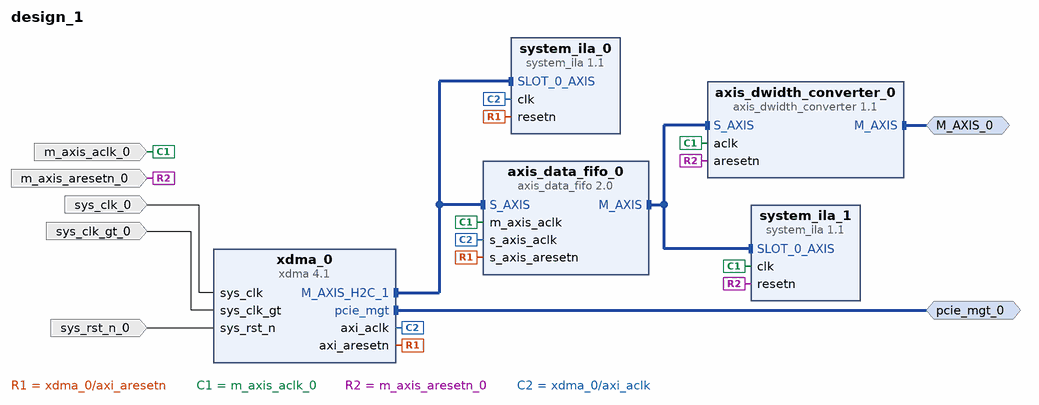
[diagram p0: block diagram of the top level]
# Vivado block design design_1, xcvu37p-fsvh2892-2L-e, Vivado 2020.2_AR75986
create_bd_design design_1

create_bd_intf_port -mode Master -vlnv xilinx.com:interface:axis_rtl:1.0 M_AXIS_0
create_bd_intf_port -mode Master -vlnv xilinx.com:interface:pcie_7x_mgt_rtl:1.0 pcie_mgt_0
create_bd_port -dir I -type clk m_axis_aclk_0
create_bd_port -dir I -type rst m_axis_aresetn_0
create_bd_port -dir I -type clk sys_clk_0
create_bd_port -dir I -type clk sys_clk_gt_0
create_bd_port -dir I -type rst sys_rst_n_0

create_bd_cell -type ip -vlnv xilinx.com:ip:axis_data_fifo:2.0 axis_data_fifo_0
set_property -dict {CONFIG.FIFO_DEPTH 16 CONFIG.IS_ACLK_ASYNC 1 CONFIG.TDATA_NUM_BYTES 64} [get_bd_cells axis_data_fifo_0]
create_bd_cell -type ip -vlnv xilinx.com:ip:axis_dwidth_converter:1.1 axis_dwidth_converter_0
set_property -dict {CONFIG.M_TDATA_NUM_BYTES 4 CONFIG.S_TDATA_NUM_BYTES 64} [get_bd_cells axis_dwidth_converter_0]
create_bd_cell -type ip -vlnv xilinx.com:ip:system_ila:1.1 system_ila_0
set_property -dict [list \
  CONFIG.C_MON_TYPE INTERFACE \
  CONFIG.C_NUM_MONITOR_SLOTS 1 \
  CONFIG.C_SLOT_0_APC_EN 0 \
  CONFIG.C_SLOT_0_AXI_DATA_SEL 1 \
  CONFIG.C_SLOT_0_AXI_TRIG_SEL 1 \
  CONFIG.C_SLOT_0_INTF_TYPE xilinx.com:interface:axis_rtl:1.0 \
] [get_bd_cells system_ila_0]
create_bd_cell -type ip -vlnv xilinx.com:ip:system_ila:1.1 system_ila_1
set_property -dict [list \
  CONFIG.C_MON_TYPE INTERFACE \
  CONFIG.C_NUM_MONITOR_SLOTS 1 \
  CONFIG.C_SLOT_0_APC_EN 0 \
  CONFIG.C_SLOT_0_AXI_DATA_SEL 1 \
  CONFIG.C_SLOT_0_AXI_TRIG_SEL 1 \
  CONFIG.C_SLOT_0_INTF_TYPE xilinx.com:interface:axis_rtl:1.0 \
] [get_bd_cells system_ila_1]
create_bd_cell -type ip -vlnv xilinx.com:ip:xdma:4.1 xdma_0
set_property -dict [list \
  CONFIG.PF0_DEVICE_ID_mqdma 903F \
  CONFIG.PF2_DEVICE_ID_mqdma 903F \
  CONFIG.PF3_DEVICE_ID_mqdma 903F \
  CONFIG.axi_data_width 512_bit \
  CONFIG.axilite_master_en true \
  CONFIG.axisten_freq 250 \
  CONFIG.mode_selection Advanced \
  CONFIG.pcie_blk_locn PCIE4C_X1Y1 \
  CONFIG.pf0_Use_Class_Code_Lookup_Assistant true \
  CONFIG.pf0_base_class_menu Processing_accelerators \
  CONFIG.pf0_device_id 903F \
  CONFIG.pf0_sub_class_interface_menu Unknown \
  CONFIG.pl_link_cap_max_link_speed 8.0_GT/s \
  CONFIG.pl_link_cap_max_link_width X16 \
  CONFIG.plltype QPLL1 \
  CONFIG.xdma_axi_intf_mm AXI_Stream \
  CONFIG.xdma_rnum_chnl 2 \
] [get_bd_cells xdma_0]

# ---- connections ----

connect_bd_intf_net -intf_net xdma_0_M_AXIS_H2C_1 [get_bd_intf_pins axis_data_fifo_0/S_AXIS] [get_bd_intf_pins xdma_0/M_AXIS_H2C_1]
connect_bd_intf_net [get_bd_intf_pins axis_data_fifo_0/S_AXIS] [get_bd_intf_pins system_ila_0/SLOT_0_AXIS]
connect_bd_intf_net -intf_net axis_data_fifo_0_M_AXIS [get_bd_intf_pins axis_data_fifo_0/M_AXIS] [get_bd_intf_pins axis_dwidth_converter_0/S_AXIS]
connect_bd_intf_net [get_bd_intf_pins axis_data_fifo_0/M_AXIS] [get_bd_intf_pins system_ila_1/SLOT_0_AXIS]
connect_bd_intf_net [get_bd_intf_ports M_AXIS_0] [get_bd_intf_pins axis_dwidth_converter_0/M_AXIS]
connect_bd_intf_net [get_bd_intf_ports pcie_mgt_0] [get_bd_intf_pins xdma_0/pcie_mgt]
connect_bd_net -net ARESETN_1 [get_bd_pins xdma_0/axi_aresetn] [get_bd_pins axis_data_fifo_0/s_axis_aresetn] [get_bd_pins system_ila_0/resetn]
connect_bd_net -net m_axis_aclk_0_1 [get_bd_ports m_axis_aclk_0] \
  [get_bd_pins axis_data_fifo_0/m_axis_aclk] [get_bd_pins axis_dwidth_converter_0/aclk] [get_bd_pins system_ila_1/clk]
connect_bd_net -net m_axis_aresetn_0_1 [get_bd_ports m_axis_aresetn_0] [get_bd_pins axis_dwidth_converter_0/aresetn] [get_bd_pins system_ila_1/resetn]
connect_bd_net -net sys_clk_0_1 [get_bd_ports sys_clk_0] [get_bd_pins xdma_0/sys_clk]
connect_bd_net -net sys_clk_gt_0_1 [get_bd_ports sys_clk_gt_0] [get_bd_pins xdma_0/sys_clk_gt]
connect_bd_net -net sys_rst_n_0_1 [get_bd_ports sys_rst_n_0] [get_bd_pins xdma_0/sys_rst_n]
connect_bd_net [get_bd_pins xdma_0/axi_aclk] [get_bd_pins axis_data_fifo_0/s_axis_aclk] [get_bd_pins system_ila_0/clk]
set_property HDL_ATTRIBUTE.DEBUG true [get_bd_intf_nets xdma_0_M_AXIS_H2C_1]
set_property HDL_ATTRIBUTE.MARK_DEBUG true [get_bd_intf_nets xdma_0_M_AXIS_H2C_1]
set_property HDL_ATTRIBUTE.DEBUG true [get_bd_intf_nets axis_data_fifo_0_M_AXIS]
set_property HDL_ATTRIBUTE.MARK_DEBUG true [get_bd_intf_nets axis_data_fifo_0_M_AXIS]

validate_bd_design
save_bd_design
